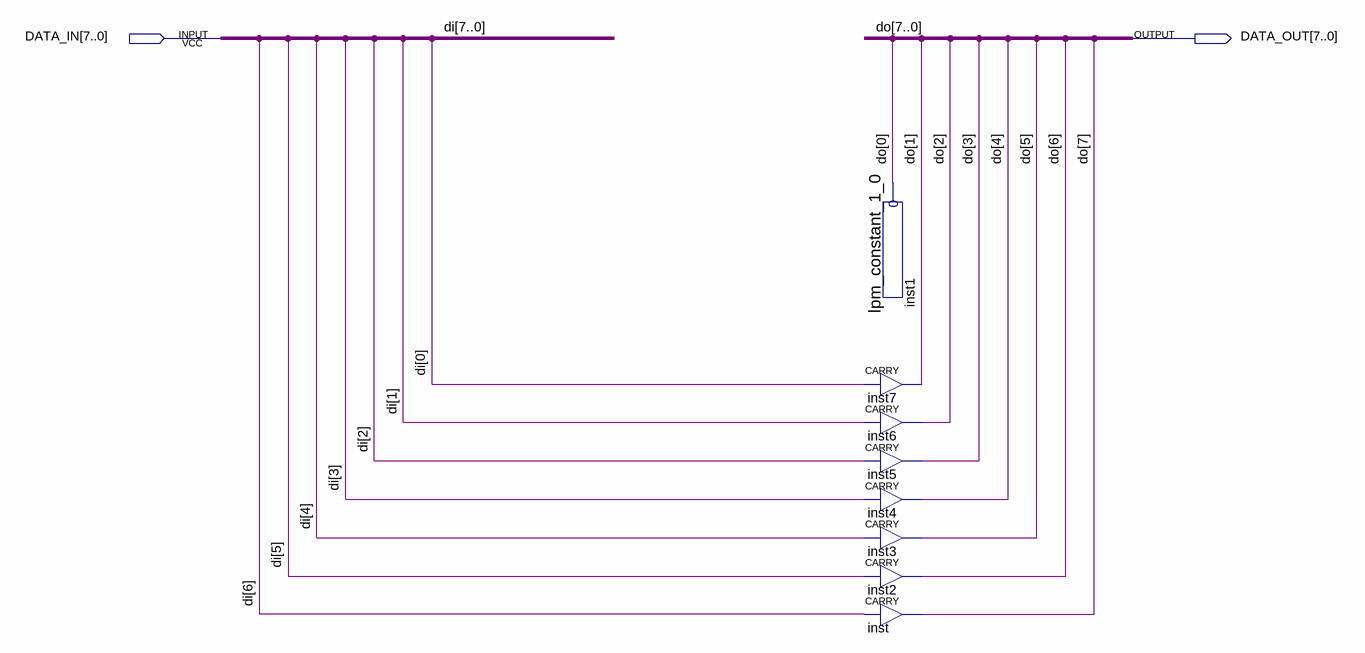
[diagram p0: schematic sheet]
// Quartus schematic oper_sla.bdf as structural Verilog: 8 symbols, 2 pins
module oper_sla (
  input  [7:0] DATA_IN,
  output [7:0] DATA_OUT
);

  lpm_constant_1_0 inst1 (.result(DATA_OUT[0]));
  CARRY inst7 (.IN(DATA_IN[0]), .OUT(DATA_OUT[1]));
  CARRY inst6 (.IN(DATA_IN[1]), .OUT(DATA_OUT[2]));
  CARRY inst5 (.IN(DATA_IN[2]), .OUT(DATA_OUT[3]));
  CARRY inst4 (.IN(DATA_IN[3]), .OUT(DATA_OUT[4]));
  CARRY inst3 (.IN(DATA_IN[4]), .OUT(DATA_OUT[5]));
  CARRY inst2 (.IN(DATA_IN[5]), .OUT(DATA_OUT[6]));
  CARRY inst (.IN(DATA_IN[6]), .OUT(DATA_OUT[7]));

  // Other names for the same wires on the sheet: di[7:0] = DATA_IN; do[7:0] = DATA_OUT
endmodule
